# EasyEDA Pro project Display.eprj

# Board PCB1
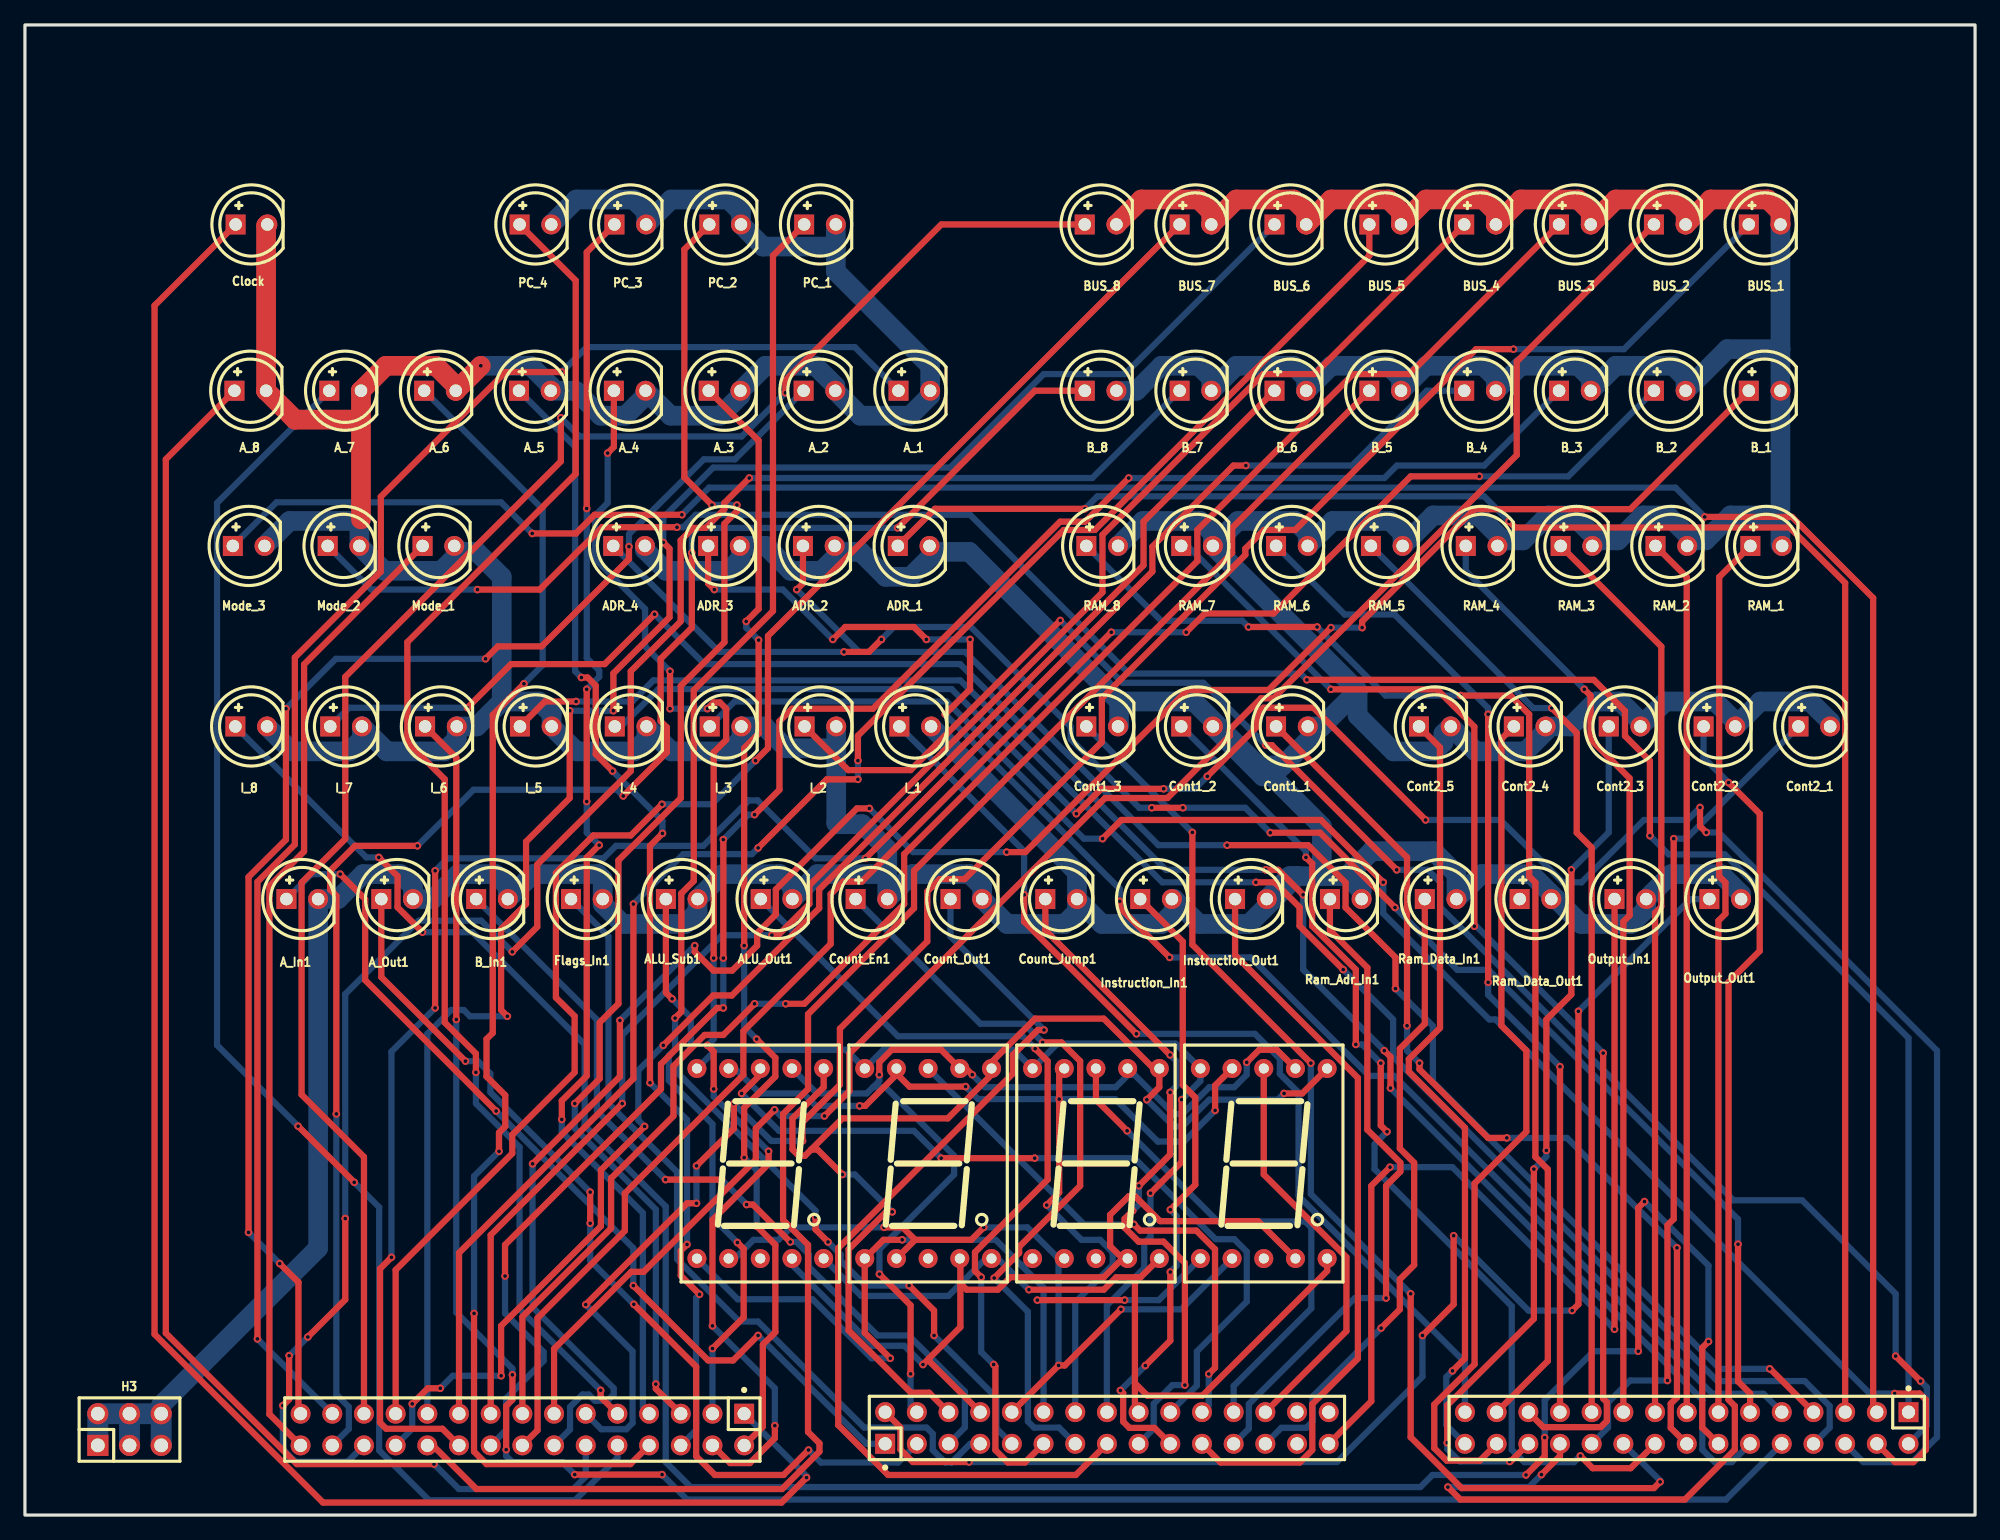
[diagram p0: board, top side]
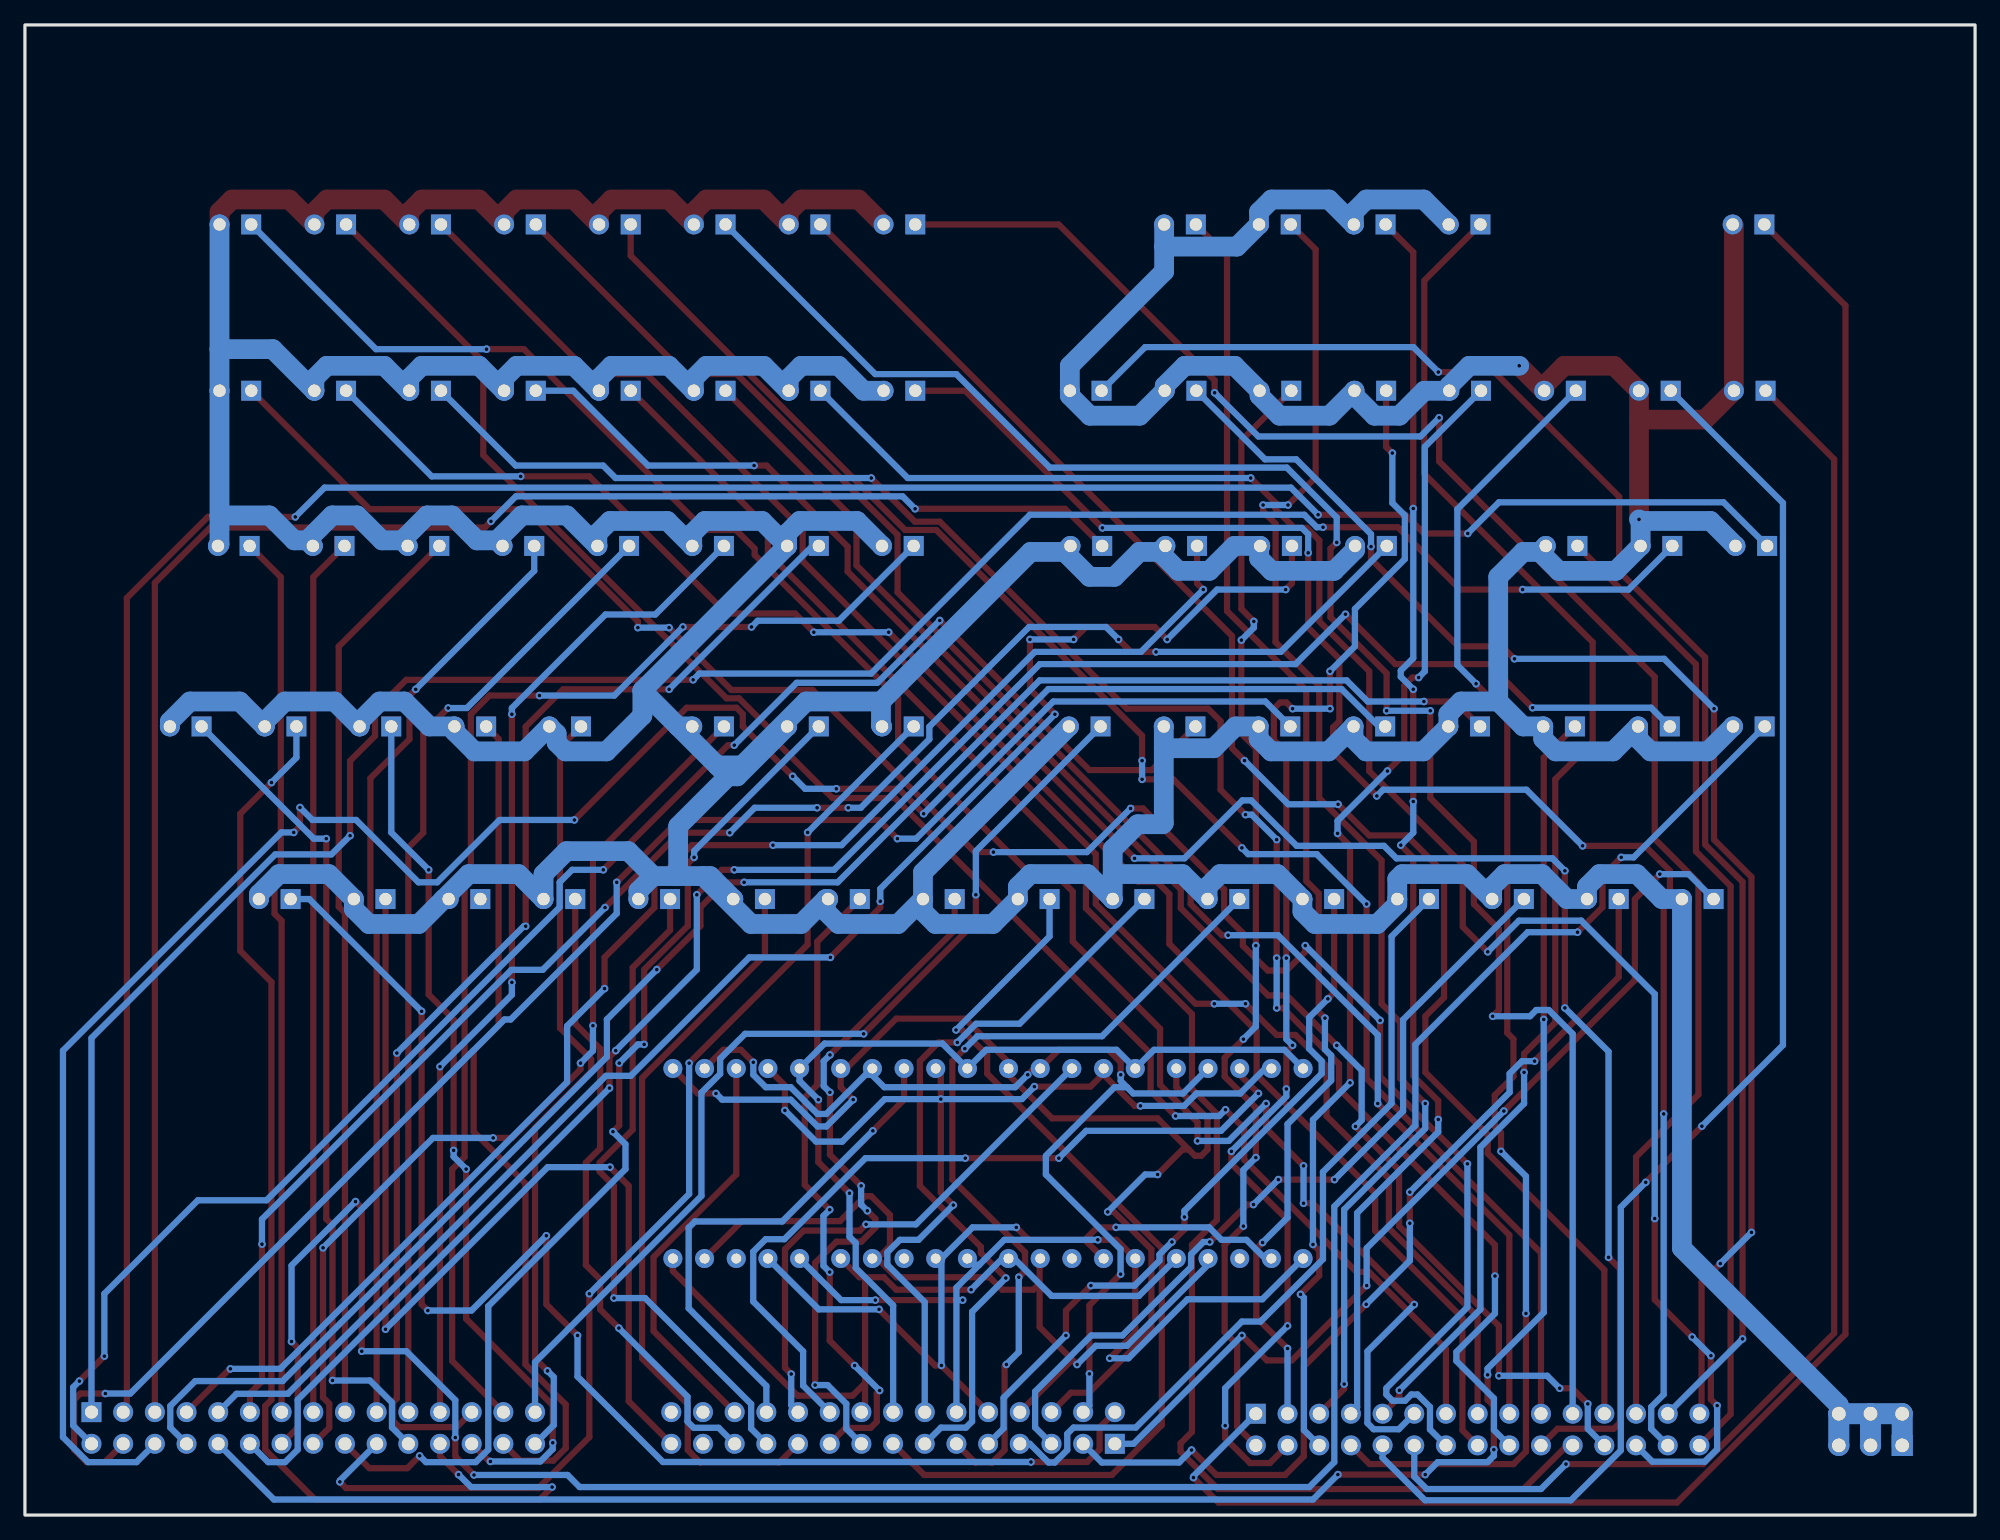
[diagram p1: board, bottom side, seen from below]

Outline 156.34 x 119.51 mm; copper layers: Top Layer, Bottom Layer. Coordinates in mm from the lower left corner of the outline.
Outline path: rectangle 0,119.51 156.34,0
Stack: Top Layer 0.035mm / Dielectric1 1.51mm FR4 er 4.5 / Bottom Layer 0.035mm

## Design rules (mm)
template: Custom Config
spacing copperThickness1oz (default): track to track 0.102, other pairs 0.152 to 0.3
spacing copperThickness2oz: track to track 0.203, other pairs 0.152 to 0.3
track width copperThickness1oz (default): min 0.127, default 0.5, max 2.54
track width copperThickness2oz: min 0.203, default 2, max 2.54
differential pair differentialPair (default): width min 0.127, default 0.254, max 2.54; gap min 0.152, default 0.152
via viaSize (default): diameter min 0.5, default 0.61, max 10; hole min 0.3, default 0.305, max 6.3
net GND uses copperThickness2oz

## Placement (name value [footprint] x y rotation side)
A_1  -  [LED-TH_BD5.8-P2.54-FD]  71.3 90.17 0 top
A_2  -  [LED-TH_BD5.8-P2.54-FD]  63.69 90.17 0 top
A_3  -  [LED-TH_BD5.8-P2.54-FD]  56.09 90.17 0 top
A_4  -  [LED-TH_BD5.8-P2.54-FD]  48.48 90.17 0 top
A_5  -  [LED-TH_BD5.8-P2.54-FD]  40.88 90.17 0 top
A_6  -  [LED-TH_BD5.8-P2.54-FD]  33.27 90.17 0 top
A_7  -  [LED-TH_BD5.8-P2.54-FD]  25.67 90.17 0 top
A_8  -  [LED-TH_BD5.8-P2.54-FD]  18.06 90.17 0 top
A_In1  -  [LED-TH_BD5.8-P2.54-FD]  22.23 49.4 0 top
A_Out1  -  [LED-TH_BD5.8-P2.54-FD]  29.84 49.4 0 top
ADR_1  -  [LED-TH_BD5.8-P2.54-FD]  71.25 77.72 0 top
ADR_2  -  [LED-TH_BD5.8-P2.54-FD]  63.64 77.72 0 top
ADR_3  -  [LED-TH_BD5.8-P2.54-FD]  56.04 77.72 0 top
ADR_4  -  [LED-TH_BD5.8-P2.54-FD]  48.43 77.72 0 top
ALU_Out1  -  [LED-TH_BD5.8-P2.54-FD]  60.26 49.4 0 top
ALU_Sub1  -  [LED-TH_BD5.8-P2.54-FD]  52.65 49.4 0 top
B_1  -  [LED-TH_BD5.8-P2.54-FD]  139.47 90.17 0 top
B_2  -  [LED-TH_BD5.8-P2.54-FD]  131.86 90.17 0 top
B_3  -  [LED-TH_BD5.8-P2.54-FD]  124.26 90.17 0 top
B_4  -  [LED-TH_BD5.8-P2.54-FD]  116.65 90.17 0 top
B_5  -  [LED-TH_BD5.8-P2.54-FD]  109.05 90.17 0 top
B_6  -  [LED-TH_BD5.8-P2.54-FD]  101.44 90.17 0 top
B_7  -  [LED-TH_BD5.8-P2.54-FD]  93.84 90.17 0 top
B_8  -  [LED-TH_BD5.8-P2.54-FD]  86.23 90.17 0 top
B_In1  -  [LED-TH_BD5.8-P2.54-FD]  37.44 49.4 0 top
BUS_1  -  [LED-TH_BD5.8-P2.54-FD]  139.47 103.51 0 top
BUS_2  -  [LED-TH_BD5.8-P2.54-FD]  131.86 103.51 0 top
BUS_3  -  [LED-TH_BD5.8-P2.54-FD]  124.26 103.51 0 top
BUS_4  -  [LED-TH_BD5.8-P2.54-FD]  116.65 103.51 0 top
BUS_5  -  [LED-TH_BD5.8-P2.54-FD]  109.05 103.51 0 top
BUS_6  -  [LED-TH_BD5.8-P2.54-FD]  101.44 103.51 0 top
BUS_7  -  [LED-TH_BD5.8-P2.54-FD]  93.84 103.51 0 top
BUS_8  -  [LED-TH_BD5.8-P2.54-FD]  86.23 103.51 0 top
Clock  -  [LED-TH_BD5.8-P2.54-FD]  18.16 103.51 0 top
Cont1_1  -  [LED-TH_BD5.8-P2.54-FD]  101.57 63.25 0 top
Cont1_2  -  [LED-TH_BD5.8-P2.54-FD]  93.97 63.25 0 top
Cont1_3  -  [LED-TH_BD5.8-P2.54-FD]  86.36 63.25 0 top
Cont2_1  -  [LED-TH_BD5.8-P2.54-FD]  143.45 63.25 0 top
Cont2_2  -  [LED-TH_BD5.8-P2.54-FD]  135.84 63.25 0 top
Cont2_3  -  [LED-TH_BD5.8-P2.54-FD]  128.24 63.25 0 top
Cont2_4  -  [LED-TH_BD5.8-P2.54-FD]  120.63 63.25 0 top
Cont2_5  -  [LED-TH_BD5.8-P2.54-FD]  113.03 63.25 0 top
Count_En1  -  [LED-TH_BD5.8-P2.54-FD]  67.86 49.4 0 top
Count_Jump1  -  [LED-TH_BD5.8-P2.54-FD]  83.07 49.4 0 top
Count_Out1  -  [LED-TH_BD5.8-P2.54-FD]  75.47 49.4 0 top
Flags_In1  -  [LED-TH_BD5.8-P2.54-FD]  45.05 49.4 0 top
H3  PZ254V-12-6P  [HDR-TH_6P-P2.54-V-M-R2-C3-S2.54]  8.38 6.86 0 top
I_1  -  [LED-TH_BD5.8-P2.54-FD]  71.37 63.25 0 top
I_2  -  [LED-TH_BD5.8-P2.54-FD]  63.77 63.25 0 top
I_3  -  [LED-TH_BD5.8-P2.54-FD]  56.16 63.25 0 top
I_4  -  [LED-TH_BD5.8-P2.54-FD]  48.56 63.25 0 top
I_5  -  [LED-TH_BD5.8-P2.54-FD]  40.95 63.25 0 top
I_6  -  [LED-TH_BD5.8-P2.54-FD]  33.35 63.25 0 top
I_7  -  [LED-TH_BD5.8-P2.54-FD]  25.74 63.25 0 top
I_8  -  [LED-TH_BD5.8-P2.54-FD]  18.14 63.25 0 top
Instruction_In1  -  [LED-TH_BD5.8-P2.54-FD]  90.68 49.4 0 top
Instruction_Out1  -  [LED-TH_BD5.8-P2.54-FD]  98.28 49.4 0 top
LED1  SM420561N  [LED-SEG-TH_10P-L12.7-W19.0-P2.54-S15.24-BL]  58.95 28.19 0 top
LED2  SM420561N  [LED-SEG-TH_10P-L12.7-W19.0-P2.54-S15.24-BL]  72.41 28.19 0 top
LED3  SM420561N  [LED-SEG-TH_10P-L12.7-W19.0-P2.54-S15.24-BL]  85.86 28.19 0 top
LED4  SM420561N  [LED-SEG-TH_10P-L12.7-W19.0-P2.54-S15.24-BL]  99.31 28.19 0 top
Mode_1  -  [LED-TH_BD5.8-P2.54-FD]  33.15 77.72 0 top
Mode_2  -  [LED-TH_BD5.8-P2.54-FD]  25.54 77.72 0 top
Mode_3  -  [LED-TH_BD5.8-P2.54-FD]  17.94 77.72 0 top
Output_In1  -  [LED-TH_BD5.8-P2.54-FD]  128.7 49.4 0 top
Output_Out1  -  [LED-TH_BD5.8-P2.54-FD]  136.31 49.4 0 top
PC_1  -  [LED-TH_BD5.8-P2.54-FD]  63.74 103.51 0 top
PC_2  -  [LED-TH_BD5.8-P2.54-FD]  56.13 103.51 0 top
PC_3  -  [LED-TH_BD5.8-P2.54-FD]  48.53 103.51 0 top
PC_4  -  [LED-TH_BD5.8-P2.54-FD]  40.92 103.51 0 top
RAM_1  -  [LED-TH_BD5.8-P2.54-FD]  139.6 77.72 0 top
RAM_2  -  [LED-TH_BD5.8-P2.54-FD]  131.99 77.72 0 top
RAM_3  -  [LED-TH_BD5.8-P2.54-FD]  124.39 77.72 0 top
RAM_4  -  [LED-TH_BD5.8-P2.54-FD]  116.78 77.72 0 top
RAM_5  -  [LED-TH_BD5.8-P2.54-FD]  109.18 77.72 0 top
RAM_6  -  [LED-TH_BD5.8-P2.54-FD]  101.57 77.72 0 top
RAM_7  -  [LED-TH_BD5.8-P2.54-FD]  93.97 77.72 0 top
RAM_8  -  [LED-TH_BD5.8-P2.54-FD]  86.36 77.72 0 top
Ram_Adr_In1  -  [LED-TH_BD5.8-P2.54-FD]  105.89 49.4 0 top
Ram_Data_In1  -  [LED-TH_BD5.8-P2.54-FD]  113.49 49.4 0 top
Ram_Data_Out1  -  [LED-TH_BD5.8-P2.54-FD]  121.1 49.4 0 top
U2  PZ254V-12-30P  [HDR-TH_30P-P2.54-V-M-R2-C15-S2.54-BL]  39.88 6.86 180 top
U3  PZ254V-12-30P  [HDR-TH_30P-P2.54-V-M-R2-C15-S2.54-BL]  133.22 6.99 180 top
U4  PZ254V-12-30P  [HDR-TH_30P-P2.54-V-M-R2-C15-S2.54-BL]  86.74 6.99 0 top

## Footprints (pads in the part's own frame, mm; a bottom-side part is the same pattern mirrored in y, then rotated)
HDR-TH_6P-P2.54-V-M-R2-C3-S2.54
  rect 1.7x1.7 hole 1.1: 1(-2.54,-1.27)
  round 1.7 hole 1.1: 2(-2.54,1.27) 3(0,-1.27) 4(0,1.27) 5(2.54,-1.27) 6(2.54,1.27)
HDR-TH_30P-P2.54-V-M-R2-C15-S2.54-BL
  rect 1.6x1.6 hole 1.05: 1(-17.78,-1.27)
  round 1.6 hole 1.05: 2(-17.78,1.27) 3(-15.24,-1.27) 4(-15.24,1.27) 5(-12.7,-1.27) 6(-12.7,1.27) 7(-10.16,-1.27) 8(-10.16,1.27) 9(-7.62,-1.27) 10(-7.62,1.27) 11(-5.08,-1.27) 12(-5.08,1.27) 13(-2.54,-1.27) 14(-2.54,1.27) 15(0,-1.27) 16(0,1.27) 17(2.54,-1.27) 18(2.54,1.27) 19(5.08,-1.27) 20(5.08,1.27) 21(7.62,-1.27) 22(7.62,1.27) 23(10.16,-1.27) 24(10.16,1.27) 25(12.7,-1.27) 26(12.7,1.27) 27(15.24,-1.27) 28(15.24,1.27) 29(17.78,-1.27) 30(17.78,1.27)
LED-SEG-TH_10P-L12.7-W19.0-P2.54-S15.24-BL
  round 1.524 hole 0.8: 1(-5.08,-7.62) 2(-2.54,-7.62) 3(0,-7.62) 4(2.54,-7.62) 5(5.08,-7.62) 6(5.08,7.62) 7(2.54,7.62) 8(0,7.62) 9(-2.54,7.62) 10(-5.08,7.62)
LED-TH_BD5.8-P2.54-FD
  rect 1.6x1.6 hole 1: 1(-1.27,0)
  round 1.6 hole 1: 2(1.27,0)

## Nets
GND: A_1.2 A_2.2 A_3.2 A_4.2 A_5.2 A_6.2 A_7.2 A_8.2 A_In1.2 A_Out1.2 ADR_1.2 ADR_2.2 ADR_3.2 ADR_4.2 ALU_Out1.2 ALU_Sub1.2 B_1.2 B_2.2 B_3.2 B_4.2 B_5.2 B_6.2 B_7.2 B_8.2 B_In1.2 BUS_1.2 BUS_2.2 BUS_3.2 BUS_4.2 BUS_5.2 BUS_6.2 BUS_7.2 BUS_8.2 Clock.2 Cont1_1.2 Cont1_2.2 Cont1_3.2 Cont2_1.2 Cont2_2.2 Cont2_3.2 Cont2_4.2 Cont2_5.2 Count_En1.2 Count_Jump1.2 Count_Out1.2 Flags_In1.2 H3.1 H3.2 H3.3 H3.4 H3.5 H3.6 I_1.2 I_2.2 I_3.2 I_4.2 I_5.2 I_6.2 I_7.2 I_8.2 Instruction_In1.2 Instruction_Out1.2 Mode_1.2 Mode_2.2 Mode_3.2 Output_In1.2 Output_Out1.2 PC_1.2 PC_2.2 PC_3.2 PC_4.2 RAM_1.2 RAM_2.2 RAM_3.2 RAM_4.2 RAM_5.2 RAM_6.2 RAM_7.2 RAM_8.2 Ram_Adr_In1.2 Ram_Data_In1.2 Ram_Data_Out1.2
A_1: A_1.1 U2.27
A_2: A_2.1 U2.29
A_3: A_3.1 U2.2
A_4: A_4.1 U2.4
A_5: A_5.1 U2.6
A_6: A_6.1 U2.8
A_7: A_7.1 U2.10
A_8: A_8.1 U2.12
A_IN: A_In1.1 U4.1
A_OUT: A_Out1.1 U4.3
ADR_1: ADR_1.1 U3.5
ADR_2: ADR_2.1 U3.7
ADR_3: ADR_3.1 U3.9
ADR_4: ADR_4.1 U3.11
ALU_OUT: ALU_Out1.1 U4.11
ALU_SUB: ALU_Sub1.1 U4.9
B_1: B_1.1 U2.14
B_2: B_2.1 U2.16
B_3: B_3.1 U2.18
B_4: B_4.1 U2.20
B_5: B_5.1 U2.22
B_6: B_6.1 U2.24
B_7: B_7.1 U2.26
B_8: B_8.1 U2.28
B_IN: B_In1.1 U4.5
BUS_1: BUS_1.1 U2.11
BUS_2: BUS_2.1 U2.13
BUS_3: BUS_3.1 U2.15
BUS_4: BUS_4.1 U2.17
BUS_5: BUS_5.1 U2.19
BUS_6: BUS_6.1 U2.21
BUS_7: BUS_7.1 U2.23
BUS_8: BUS_8.1 U2.25
CLOCK: Clock.1 U2.1
CONT1_1: Cont1_1.1 U3.16
CONT1_2: Cont1_2.1 U3.18
CONT1_3: Cont1_3.1 U3.20
CONT2_1: Cont2_1.1 U3.22
CONT2_2: Cont2_2.1 U3.24
CONT2_3: Cont2_3.1 U3.26
CONT2_4: Cont2_4.1 U3.28
CONT2_5: Cont2_5.1 U3.30
COUNT_EN: Count_En1.1 U4.13
COUNT_JUMP: Count_Jump1.1 U4.17
COUNT_OUT: Count_Out1.1 U4.15
DISP_A: LED1.7 LED2.7 LED3.7 LED4.7 U4.4
DISP_B: LED1.6 LED2.6 LED3.6 LED4.6 U4.6
DISP_C: LED1.4 LED2.4 LED3.4 LED4.4 U4.8
DISP_D: LED1.2 LED2.2 LED3.2 LED4.2 U4.10
DISP_DP: LED1.5 LED2.5 LED3.5 LED4.5 U4.18
DISP_E: LED1.1 LED2.1 LED3.1 LED4.1 U4.12
DISP_F: LED1.9 LED2.9 LED3.9 LED4.9 U4.14
DISP_G: LED1.10 LED2.10 LED3.10 LED4.10 U4.16
DISP_GND_1: LED1.8 U4.20
DISP_GND_2: LED2.8 U4.22
DISP_GND_3: LED3.8 U4.24
DISP_GND_4: LED4.8 U4.26
FLAGS_IN: Flags_In1.1 U4.7
HLT: Output_Out1.1 U4.2
I_1: I_1.1 U3.29
I_2: I_2.1 U3.2
I_3: I_3.1 U3.4
I_4: I_4.1 U3.6
I_5: I_5.1 U3.8
I_6: I_6.1 U3.10
I_7: I_7.1 U3.12
I_8: I_8.1 U3.14
INSTRUCTION_IN: Instruction_In1.1 U4.19
INSTRUCTION_OUT: Instruction_Out1.1 U4.21
MODE_1: Mode_1.1 U2.30
MODE_2: Mode_2.1 U3.1
MODE_3: Mode_3.1 U3.3
OUTPUT_IN: Output_In1.1 U4.29
PC_1: PC_1.1 U2.3
PC_2: PC_2.1 U2.5
PC_3: PC_3.1 U2.7
PC_4: PC_4.1 U2.9
RAM_1: RAM_1.1 U3.13
RAM_2: RAM_2.1 U3.15
RAM_3: RAM_3.1 U3.17
RAM_4: RAM_4.1 U3.19
RAM_5: RAM_5.1 U3.21
RAM_6: RAM_6.1 U3.23
RAM_7: RAM_7.1 U3.25
RAM_8: RAM_8.1 U3.27
RAM_ADR_IN: Ram_Adr_In1.1 U4.23
RAM_DATA_IN: Ram_Data_In1.1 U4.25
RAM_DATA_OUT: U4.27
$1N6232: Ram_Data_Out1.1

Pads without a net: LED1 3; LED2 3; LED3 3; LED4 3; U4 28 30

## Via types
v1: diameter 0.61, hole 0.305, Top Layer to Bottom Layer, 286 vias

## Routing (per net, layer and track width the routed paths; a pad name or vN(x,y) marks a point on that pad's centre or on a via; arc(x,y) is an arc through that point)
GND: length 863
  Top Layer w1.577: BUS_8.2 89.5,105.51 94.11,105.51 95.11,104.51 BUS_7.2 97.11,105.51 101.71,105.51 102.71,104.51 BUS_6.2 104.71,105.51 109.32,105.51 110.32,104.51 BUS_5.2 112.32,105.51 116.92,105.51 117.92,104.51 BUS_4.2 119.92,105.51 124.53,105.51 125.53,104.51 BUS_3.2 127.53,105.51 132.13,105.51 133.13,104.51 BUS_2.2 135.13,105.51 139.74,105.51 140.74,104.51 BUS_1.2 ; v1(36.54,92.17) A_6.2 34.54,90.57 32.94,92.17 28.94,92.17 A_7.2 26.94,87.85 ; 26.94,87.85 21.65,87.85 A_8.2 19.33,103.41 Clock.2 ; 26.94,87.85 v1(26.94,79.85)
  Bottom Layer w1.577: 57.39,77.72 59.39,77.72 61.39,75.72 63.87,75.72 65.39,77.25 ; 57.39,77.72 ADR_3.2 ; 57.39,77.72 57.39,76.72 56.39,75.72 51.39,75.72 49.7,77.41 ADR_4.2 ; 118.5,78.17 116.5,80.17 112.89,80.17 RAM_5.2 110.44,78.72 109.44,79.72 104.84,79.72 RAM_6.2 102.84,78.72 101.84,79.72 97.24,79.72 RAM_7.2 ; 118.5,78.17 120.1,78.17 122.1,80.17 124.1,80.17 126.1,78.17 ; 118.5,78.17 RAM_4.2 ; 103.97,63.25 100.84,60.12 ; 103.97,63.25 106.84,66.12 ; 103.97,63.25 Cont1_1.2 ; 100.84,60.12 98.84,60.12 93.71,65.25 87.71,65.25 ; 100.84,60.12 99.97,59.25 ; 105.97,51.25 107.97,53.25 112.92,53.25 114.76,51.4 Ram_Data_In1.2 116.76,51.4 120.76,51.4 122.76,49.4 ; 105.97,51.25 103.97,51.25 ; 105.97,51.25 107.16,50.06 Ram_Adr_In1.2 ; 140.74,93.51 B_1.2 140.74,80.17 ; 140.74,93.51 BUS_1.2 ; 140.74,93.51 136.47,93.51 B_2.2 133.13,91.17 132.13,92.17 127.53,92.17 B_3.2 125.53,91.17 124.53,92.17 119.92,92.17 B_4.2 117.92,91.17 116.92,92.17 112.32,92.17 B_5.2 110.32,91.17 109.32,92.17 104.71,92.17 B_6.2 102.71,91.17 101.71,92.17 97.11,92.17 B_7.2 95.11,91.17 94.11,92.17 91.11,92.17 89.11,90.17 B_8.2 ; 87.71,65.25 75.71,77.25 73,77.25 ; 87.71,65.25 87.71,63.33 Cont1_3.2 ; 126.1,78.17 127.71,78.17 129.71,80.17 131.71,80.17 133.71,78.17 ; 126.1,78.17 RAM_3.2 ; 65.39,77.25 ADR_2.2 ; 65.39,77.25 67,77.25 69,75.25 71,75.25 73,77.25 ; 122.76,49.4 124.76,47.4 128.76,47.4 129.97,48.61 Output_In1.2 131.97,51.4 135.97,51.4 137.58,49.8 Output_Out1.2 ; 122.76,49.4 Ram_Data_Out1.2 ; 69.13,51.4 Count_En1.2 71.13,51.4 75.74,51.4 76.74,50.4 Count_Out1.2 78.74,47.4 83.34,47.4 84.34,48.4 Count_Jump1.2 ; 69.13,51.4 63.53,51.4 ALU_Out1.2 61.53,50.4 60.53,51.4 55.92,51.4 ALU_Sub1.2 53.92,48.4 52.92,47.4 47.92,47.4 46.32,49.01 46.32,51.01 45.92,51.4 40.71,51.4 B_In1.2 38.71,50.4 37.71,51.4 34.71,51.4 32.71,49.4 A_Out1.2 31.11,50.4 30.11,51.4 27.11,51.4 25.11,49.4 A_In1.2 23.5,21.4 10.92,8.82 H3.6 ; 69.13,51.4 69.13,53.4 67.13,55.4 65.13,55.4 65.04,55.5 65.04,61.5 ; 38.22,65.25 36.22,63.25 I_6.2 34.62,62.25 33.62,61.25 29.01,61.25 I_7.2 27.01,62.25 26.01,61.25 21.41,61.25 I_8.2 ; 38.22,65.25 38.22,75.25 36.22,77.25 34.9,77.25 ; 38.22,65.25 41.22,65.25 42.22,64.25 I_5.2 44.22,61.25 48.83,61.25 49.83,62.25 I_4.2 51.83,61.25 56.43,61.25 57.43,62.25 I_3.2 59.29,63.25 61.04,61.5 65.04,61.5 ; 140.74,80.17 140.74,77.85 RAM_1.2 ; 140.74,80.17 136.74,80.17 134.74,78.17 133.71,78.17 ; 73,77.25 ADR_1.2 ; 133.71,78.17 RAM_2.2 ; 34.9,77.25 33.37,75.72 28.81,75.72 Mode_2.2 26.81,79.72 ; 34.9,77.25 Mode_1.2 ; 99.97,59.25 103.97,55.25 103.97,51.25 ; 99.97,59.25 99.24,59.25 Cont1_2.2 ; 106.84,66.12 106.84,64.12 109.71,61.25 113.01,61.25 113.71,61.95 113.71,62.66 Cont2_5.2 116.3,61.25 120.3,61.25 121.91,62.85 Cont2_4.2 123.91,63.25 125.91,65.25 127.91,65.25 129.51,63.64 Cont2_3.2 131.51,65.25 135.51,65.25 137.12,63.64 Cont2_2.2 139.12,65.25 143.12,65.25 144.72,63.64 Cont2_1.2 ; 106.84,66.12 RAM_7.2 ; PC_4.2 44.19,105.51 48.8,105.51 49.8,104.51 PC_3.2 51.8,105.51 56.4,105.51 57.4,104.51 57.4,103.51 59.18,101.73 65.01,101.73 ; Mode_3.2 21.21,79.72 26.81,79.72 ; 26.81,79.72 v1(26.94,79.85) ; RAM_8.2 89.63,79.72 94.24,79.72 95.24,78.72 RAM_7.2 ; 65.01,101.73 65.01,99.73 72.57,92.17 A_1.2 72.57,89.78 70.96,88.17 66.96,88.17 A_2.2 64.96,90.57 63.36,92.17 59.36,92.17 A_3.2 57.36,89.78 55.75,88.17 51.75,88.17 A_4.2 49.75,89.78 48.15,88.17 46.15,88.17 44.15,90.17 A_5.2 42.15,90.57 40.54,92.17 v1(36.54,92.17) ; 65.01,101.73 PC_1.2 ; 101.97,51.25 101.4,51.25 Instruction_Out1.2 ; 101.97,51.25 103.97,51.25 ; 101.97,51.25 98.12,47.4 94.12,47.4 92.12,49.4 ; 92.12,49.4 92.12,48.4 91.12,47.4 86.34,47.4 Count_Jump1.2 ; 92.12,49.4 Instruction_In1.2 ; 65.04,61.5 I_2.2 ; Count_Jump1.2 84.34,51.55 I_1.2
  Bottom Layer w1.675: H3.4 H3.6 H3.5 ; H3.4 H3.2 H3.1 ; H3.4 H3.3
A_1: length 128
  Top Layer w0.5: v1(18.64,14.13) 18.64,50.78 21.64,53.78 21.64,68.78 28.53,75.67 28.53,81.67 38.53,91.67 v1(43.03,91.67)
  Bottom Layer w0.5: v1(18.64,14.13) U2.27 ; v1(43.03,91.67) 45.03,93.67 66.53,93.67 A_1.1
A_2: length 112.7
  Top Layer w0.5: v1(17.92,22.67) 17.92,51.17 20.92,54.17 v1(20.92,64.67) ; v1(36.92,68.67) 37.92,69.67 41.42,69.67 48.42,76.67 v1(48.42,77.67) ; v1(20.42,20.17) 21.92,18.67 21.92,8.3 U2.29
  Bottom Layer w0.5: v1(36.92,68.67) 24.92,68.67 v1(20.92,64.67) ; v1(48.42,77.67) 48.42,78.67 54.42,84.67 56.92,84.67 A_2.1 ; v1(17.92,22.67) v1(20.42,20.17)
A_3: length 91.7
  Top Layer w0.5: v1(57.66,45.67) 57.66,61.51 58.82,62.67 v1(58.82,70.17) ; U2.2 59.16,7.09 59.16,13.67 60.16,14.67 60.16,21.67 v1(58.66,23.17) ; v1(57.82,71.67) 58.82,72.67 58.82,86.17 A_3.1 ; v1(57.66,28.67) 57.66,32.67 60.16,35.17 60.16,36.67 v1(58.66,38.17)
  Bottom Layer w0.5: v1(58.66,23.17) 58.66,27.67 v1(57.66,28.67) ; v1(57.66,45.67) 57.66,39.17 v1(58.66,38.17) ; v1(57.82,71.67) 57.82,71.17 v1(58.82,70.17)
A_4: length 105
  Top Layer w0.5: v1(54.71,37.67) 55.21,37.17 v1(55.21,34.17) ; v1(60.12,7.17) 60.12,6.17 58.12,4.17 56.54,4.17 55.12,5.59 ; v1(46.71,85.17) 47.21,85.67 A_4.1 ; v1(55.12,15.17) 55.12,23.67 59.62,28.17 v1(59.62,29.17) ; v1(54.71,64.67) 55.21,65.17 55.71,65.17 56.21,64.67 56.21,62.17 55.21,61.17 v1(55.21,44.67) ; v1(51.71,67.67) v1(51.71,64.67)
  Bottom Layer w0.5: v1(55.21,44.67) 55.21,38.17 v1(54.71,37.67) ; v1(55.12,15.17) 60.12,10.17 v1(60.12,7.17) ; v1(46.71,85.17) 46.71,81.17 45.71,80.17 45.71,76.67 49.71,72.67 49.71,69.67 v1(51.71,67.67) ; v1(51.71,64.67) v1(54.71,64.67) ; v1(59.62,29.17) 55.21,33.57 v1(55.21,34.17)
A_5: length 92.7
  Top Layer w0.5: v1(53.08,21.7) 52.58,21.2 52.58,19.2 v1(54.08,17.7) ; v1(47.11,59.67) 45.76,61.02 45.76,66.52 45.11,67.17 v1(44.61,67.17) ; v1(51.11,54.67) 50.11,53.67 v1(50.11,34.67)
  Bottom Layer w0.5: v1(50.11,34.67) 53.08,31.7 v1(53.08,21.7) ; v1(54.08,17.7) 53.8,17.43 53.8,6.81 U2.6 ; A_5.1 44.11,85.67 44.11,67.67 v1(44.61,67.17) ; v1(51.11,54.67) 51.11,55.67 v1(47.11,59.67)
A_6: length 107.6
  Top Layer w0.5: v1(36,16.17) 36,5.09 37,4.09 48.54,4.09 50.04,5.59 ; v1(40,66.67) 37.5,64.17 37.5,38.67 37,38.17 37,35.17 38.5,33.67 38.5,31.17 38,30.67 v1(38,29.17)
  Bottom Layer w0.5: v1(36,16.17) 36,27.17 v1(38,29.17) ; A_6.1 41.5,80.67 41.5,68.17 v1(40,66.67)
A_7: length 117.3
  Top Layer w0.5: v1(21.9,31.19) v1(26.4,26.69)
  Bottom Layer w0.5: v1(21.9,31.19) 15.4,37.69 15.4,81.17 A_7.1 ; v1(26.4,26.69) 28.4,24.69 28.4,5.19 32.4,1.19 44.1,1.19 47.5,4.59 U2.10
A_8: length 119.6
  Top Layer w0.5: v1(32.79,4.09) 21.79,4.09 11.29,14.59 11.29,84.67 A_8.1
  Bottom Layer w0.5: U2.12 44.96,3.09 43.96,2.09 34.79,2.09 v1(32.79,4.09)
A_IN: length 75
  Top Layer w0.5: v1(48.77,18.4) 54.77,12.4 56.77,12.4 v1(58.77,14.4) ; v1(25.27,51.4) 27.27,49.4 27.27,42.9 v1(37.77,32.4)
  Bottom Layer w0.5: v1(58.77,14.4) 67.46,5.72 U4.1 ; v1(37.77,32.4) 48.77,21.4 v1(48.77,18.4) ; A_In1.1 22.96,51.4 v1(25.27,51.4)
A_OUT: length 75.9
  Top Layer w0.5: A_Out1.1 28.57,43.15 v1(35.31,36.4) ; v1(48.81,16.9) 53.81,11.9 53.81,4.72 55.31,3.22 60.81,3.22 v1(62.81,5.22) ; v1(45.31,25.9) v1(45.31,23.4)
  Bottom Layer w0.5: v1(45.31,25.9) 37.31,33.9 37.31,35.4 36.31,36.4 v1(35.31,36.4) ; v1(48.81,16.9) 45.31,20.4 v1(45.31,23.4) ; v1(62.81,5.22) 63.81,4.22 70,4.22 U4.3
ADR_1: length 147
  Top Layer w0.5: v1(84.98,80.7) 72.95,80.7 ADR_1.1 ; U3.5 145.92,74.76 141.48,79.2 119.48,79.2 v1(118.98,79.7)
  Bottom Layer w0.5: v1(84.98,80.7) 85.98,81.7 116.98,81.7 v1(118.98,79.7)
ADR_2: length 117.8
  Top Layer w0.5: U3.7 139.91,11.72 v1(139.87,11.72) ; v1(61.87,74.22) 62.37,74.72 ADR_2.1 ; v1(96.37,53.72) 102.87,53.72 105.87,50.72 105.87,48.72 109.87,44.72 v1(109.87,42.22)
  Bottom Layer w0.5: v1(139.87,11.72) 135.87,11.72 112.87,34.72 112.87,39.22 v1(109.87,42.22) ; v1(61.87,74.22) 66.87,69.22 75.37,69.22 90.87,53.72 v1(96.37,53.72)
ADR_3: length 124.7
  Top Layer w0.5: v1(64.77,70.22) 65.77,71.22 71.27,71.22 v1(72.27,70.22) ; v1(91.77,44.72) 87.77,48.72 v1(87.77,49.22) ; v1(55.27,74.22) 54.77,74.72 ADR_3.1 ; v1(73.77,64.22) 75.77,66.22 v1(75.77,70.22)
  Bottom Layer w0.5: v1(91.77,44.72) 98.27,44.72 107.77,35.22 109.77,35.22 135.27,9.72 139.37,9.72 U3.9 ; v1(87.77,49.22) 87.77,50.22 v1(73.77,64.22) ; v1(64.77,70.22) 60.77,74.22 v1(55.27,74.22) ; v1(72.27,70.22) v1(75.77,70.22)
ADR_4: length 130.7
  Top Layer w0.5: v1(99.83,54.72) 103.83,54.72 v1(109.83,48.72) ; v1(137.33,21.72) 137.33,10.72 138.3,9.75 U3.11 ; v1(65.66,69.22) 67.66,69.22 v1(68.66,70.22) ; v1(90.33,56.72) v1(92.83,56.72)
  Bottom Layer w0.5: ADR_4.1 55.66,69.22 v1(65.66,69.22) ; v1(109.83,48.72) 114.83,43.72 117.33,43.72 137.33,23.72 v1(137.33,21.72) ; v1(92.83,56.72) 97.83,56.72 v1(99.83,54.72) ; v1(90.33,56.72) 89.33,56.72 83.83,62.22 83.83,63.22 75.83,71.22 69.66,71.22 v1(68.66,70.22)
ALU_OUT: length 67.6
  Top Layer w0.5: v1(77.66,12.08) 77.8,11.94 77.8,5.22 78.8,4.22 80.16,4.22 U4.11 ; v1(80.99,37.4) 81.99,36.4 81.99,26.9 76.16,21.08 76.16,19.58 v1(76.66,19.08)
  Bottom Layer w0.5: v1(80.99,37.4) 79.99,38.4 69.99,38.4 ALU_Out1.1 ; v1(76.66,19.08) 76.66,13.08 v1(77.66,12.08)
ALU_SUB: length 58.1
  Top Layer w0.5: v1(72.88,14.4) 72.88,16.4 v1(70.88,18.4) ; v1(64.38,21.9) 63.38,22.9 v1(63.38,23.9) ; v1(51.88,41.4) 51.38,41.9 ALU_Sub1.1
  Bottom Layer w0.5: U4.9 77.88,6.95 77.88,9.4 v1(72.88,14.4) ; v1(64.38,21.9) 65.38,20.9 65.38,20.4 67.38,18.4 v1(70.88,18.4) ; v1(51.88,41.4) 53.38,39.9 53.38,37.4 52.38,36.4 52.38,35.4 63.38,24.4 v1(63.38,23.9)
B_1: length 161.8
  Top Layer w0.5: v1(107.2,71.17) 107.2,71.67 116.2,80.67 128.7,80.67 B_1.1 ; v1(78.7,53.17) 80.2,53.17 93.2,66.17 99.7,66.17 v1(104.7,71.17) ; v1(40.7,28.17) 47.7,35.17 v1(47.7,39.67) ; v1(53.7,45.67) 53.7,45.17 55.2,43.67 56.7,43.67 58.7,45.67 58.7,46.67 60.2,48.17 60.2,50.17 66.7,56.67 v1(67.7,56.67)
  Bottom Layer w0.5: v1(107.2,71.17) v1(104.7,71.17) ; v1(67.7,56.67) 71.2,53.17 v1(78.7,53.17) ; v1(53.7,45.67) v1(47.7,39.67) ; v1(40.7,28.17) 40.7,16.67 47.2,10.17 47.2,9.67 46.7,9.17 45.7,9.17 45.2,9.67 44.7,9.67 43.7,8.67 43.7,6.87 U2.14
B_2: length 137.2
  Top Layer w0.5: v1(87.09,70.8) 67.09,50.8 65.59,50.8 64.59,49.8 64.59,45.8 57.59,38.8 57.59,35.3 48.09,25.8 48.09,22.8 41.09,15.8 41.09,6.8 U2.16 ; v1(116.59,83.3) 111.09,83.3 100.09,72.3 94.59,72.3 v1(93.09,70.8)
  Bottom Layer w0.5: v1(93.09,70.8) v1(87.09,70.8) ; v1(116.59,83.3) 123.73,83.3 B_2.1
B_3: length 144.3
  Top Layer w0.5: v1(88.49,83.17) 84.99,79.67 82.99,79.67 67.99,64.67 61.49,64.67 60.49,63.67 60.49,58.17 v1(58.49,56.17) ; v1(55.99,40.67) 55.49,40.67 50.99,36.17 50.99,34.17 38.49,21.67 v1(38.49,19.17) ; v1(55.99,54.17) v1(55.99,44.67)
  Bottom Layer w0.5: v1(38.49,19.17) 38.49,16.17 41.58,13.07 41.58,12.37 38.57,9.35 38.57,6.82 37.34,5.59 ; B_3.1 116.99,84.17 109.99,84.17 108.99,83.17 v1(88.49,83.17) ; v1(55.99,54.17) 57.99,56.17 v1(58.49,56.17) ; v1(55.99,44.67) v1(55.99,40.67)
B_4: length 156.6
  Top Layer w0.5: v1(97.88,84.17) 96.88,84.17 90.38,77.67 90.38,75.67 v1(67.38,52.67) ; U2.20 33.47,6.92 28.97,6.92 28.47,7.42 28.47,19.75 v1(29.38,20.67) ; v1(32.88,51.67) v1(32.88,40.67)
  Bottom Layer w0.5: v1(67.38,52.67) 63.38,52.67 58.74,57.32 58.03,57.32 54.38,53.67 47.38,53.67 46.38,52.67 33.88,52.67 v1(32.88,51.67) ; v1(97.88,84.17) 106.38,84.17 112.38,90.17 B_4.1 ; v1(29.38,20.67) 29.38,37.17 v1(32.88,40.67)
B_5: length 139.9
  Top Layer w0.5: B_5.1 96.78,79.17 96.78,77.17 71.28,51.67 71.28,48.67 62.78,40.17 62.78,34.17 60.78,32.17 60.78,23.67 62.78,21.67 62.78,6.67 63.7,5.75 63.7,5.09 60.7,2.09 36.2,2.09 32.7,5.59 32.26,5.59
B_6: length 117.9
  Top Layer w0.5: v1(31.05,8.92) 32.3,10.17 v1(33.3,10.17) ; B_6.1 89.67,79.67 89.67,76.17 63.67,50.17 63.67,48.67 56.67,41.67 55.17,41.67 v1(51.17,37.67) ; v1(38.17,11.17) 38.17,15.17 46.17,23.17 46.17,27.67 v1(49.67,31.17)
  Bottom Layer w0.5: U2.24 31.05,6.92 v1(31.05,8.92) ; v1(51.17,37.67) 49.17,35.67 49.17,31.67 v1(49.67,31.17) ; v1(33.3,10.17) 34.3,11.17 v1(38.17,11.17)
B_7: length 146.7
  Top Layer w0.5: v1(25.68,23.78) 25.68,17.28 v1(22.68,14.28) ; v1(21.18,12.78) 21.18,9.28 v1(20.68,8.78) ; v1(58.07,83.17) 56.07,81.17 56.07,80.67 54.57,79.17 53.57,79.17 52.57,78.17 52.57,71.67 48.57,67.67 48.57,59.67 41.07,52.17 41.07,47.17 v1(39.07,45.17)
  Bottom Layer w0.5: v1(25.68,23.78) 25.68,41.78 31.57,47.67 36.57,47.67 v1(39.07,45.17) ; v1(58.07,83.17) 85.57,83.17 B_7.1 ; U2.26 25.87,4.28 21.68,4.28 20.68,5.28 v1(20.68,8.78) ; v1(22.68,14.28) v1(21.18,12.78)
B_8: length 133.6
  Top Layer w0.5: B_8.1 80.96,90.17 v1(69.96,79.17) ; v1(24.96,32.17) 24.96,49.67 24.46,50.17 24.46,51.67 26.46,53.67 v1(31.46,53.67) ; v1(47.96,57.67) 51.46,61.17 51.46,63.17 50.96,63.67 50.96,68.67 53.46,71.17 v1(53.46,77.17)
  Bottom Layer w0.5: v1(31.46,53.67) 35.96,58.17 47.46,58.17 v1(47.96,57.67) ; v1(69.96,79.17) 53.96,79.17 53.46,78.67 v1(53.46,77.17) ; U2.28 25.96,6.91 25.96,8.67 24.96,9.67 v1(24.96,32.17)
B_IN: length 65.1
  Top Layer w0.5: v1(51.35,26.9) v1(55.85,26.9) ; v1(57.85,24.9) 58.35,24.9 v1(61.35,21.9)
  Bottom Layer w0.5: v1(55.85,26.9) v1(57.85,24.9) ; v1(61.35,21.9) 61.85,21.9 62.85,20.9 62.85,19.9 68.35,14.4 70.85,14.4 75.35,9.9 75.35,7.03 U4.5 ; v1(51.35,26.9) 45.85,32.4 45.85,39.72 B_In1.1
BUS_1: length 158.3
  Top Layer w0.5: v1(62.34,30) 62.34,31.5 65.34,34.5 65.34,39.01 72.34,46.01 72.34,50.01 73.34,51.01 75.34,51.01 86.34,62.01 86.34,65.51 97.84,77.01 97.84,77.51 99.34,79.01 101.84,79.01 116.34,93.51 v1(119.34,93.51) ; v1(56.84,33) 56.84,31 v1(53.84,28) ; v1(44.96,16.88) 53.08,25 v1(53.84,25)
  Bottom Layer w0.5: v1(53.84,28) v1(53.84,25) ; U2.11 46.2,6.88 48.21,6.88 48.71,7.38 48.71,13.13 v1(44.96,16.88) ; v1(119.34,93.51) 128.2,93.51 BUS_1.1 ; v1(62.34,30) 59.84,30 v1(56.84,33)
BUS_2: length 139.1
  Top Layer w0.5: BUS_2.1 119.59,92.51 119.59,85.01 100.09,65.51 99.09,65.51 96.59,63.01 96.59,62.51 91.59,57.51 86.59,57.51 66.09,37 66.09,34 v1(64.09,32) ; v1(60.09,32.5) 58.59,31 58.59,28.5 49.59,19.5 48.59,19.5 42.42,13.33 U2.13
  Bottom Layer w0.5: v1(60.09,32.5) 60.59,32 v1(64.09,32)
BUS_3: length 135.7
  Top Layer w0.5: U2.15 39.88,15.89 46.99,23 46.99,27 51.99,32 51.99,36 54.49,38.51 55.99,38.51 v1(58.49,41.01) ; BUS_3.1 110.99,91.51 106.49,91.51 93.99,79.01 93.99,76.51 70.49,53.01 70.49,49.01 62.49,41.01 v1(60.99,41.01)
  Bottom Layer w0.5: v1(60.99,41.01) v1(58.49,41.01)
BUS_4: length 132.7
  Top Layer w0.5: 37.34,8.13 37.34,22.46 v1(47.88,33) ; v1(59.88,46.51) 60.38,46.51 62.88,49.01 62.88,50.51 86.38,74.01 86.38,78.61 99.28,91.51 103.38,91.51 BUS_4.1
  Bottom Layer w0.5: v1(59.88,46.51) 55.88,46.51 47.88,38.51 v1(47.88,33)
BUS_5: length 131.8
  Top Layer w0.5: v1(58.78,53.51) 64.28,59.01 v1(66.78,59.01) ; BUS_5.1 107.78,101.01 85.78,79.01 83.28,79.01 66.78,62.51 v1(66.78,60.51) ; U2.19 34.8,21.03 48.78,35 v1(48.78,49.01)
  Bottom Layer w0.5: v1(58.78,53.51) 58.28,53.01 52.78,53.01 v1(48.78,49.01) ; v1(66.78,60.51) v1(66.78,59.01)
BUS_6: length 144.7
  Top Layer w0.5: v1(38.67,40.01) 38.17,40.51 38.17,47.01 40.17,49.01 40.17,54.01 43.67,57.51 v1(43.67,64.51) ; v1(47.17,64.51) 47.17,67.51 51.67,72.01 51.67,77.51 v1(51.17,78.01)
  Bottom Layer w0.5: v1(51.17,78.01) 51.17,80.01 55.17,84.01 74.17,84.01 81.67,91.51 88.17,91.51 BUS_6.1 ; v1(47.17,64.51) v1(43.67,64.51) ; v1(38.67,40.01) 35.67,40.01 35.17,40.51 34.17,40.51 32.26,38.59 32.26,8.13
BUS_7: length 126.8
  Top Layer w0.5: v1(51.07,57.01) 48.57,54.51 45.57,54.51 42.57,51.51 42.57,41.51 44.07,40.01 44.07,35.5 39.07,30.5 39.07,29 29.72,19.66 U2.23 ; BUS_7.1 59.57,70.51 59.57,61.51 v1(58.57,60.51)
  Bottom Layer w0.5: v1(58.57,60.51) 55.07,57.01 v1(51.07,57.01)
BUS_8: length 140.8
  Top Layer w0.5: v1(60.96,90.01) 60.96,91.01 73.46,103.51 BUS_8.1 ; v1(42.96,88.01) 42.96,84.51 25.68,67.22 25.68,54.22 22.18,50.72 22.18,33.72 27.18,28.72 U2.25
  Bottom Layer w0.5: v1(60.96,90.01) 57.46,86.51 44.46,86.51 v1(42.96,88.01)
CLOCK: length 157.6
  Top Layer w0.5: v1(62.66,3) 60.66,1 23.89,1 10.39,14.5 10.39,97.01 Clock.1
  Bottom Layer w0.5: v1(62.66,3) 62.66,3.13 U2.1
CONT1_1: length 75.3
  Top Layer w0.5: v1(111.8,36.25) 111.8,35.75 117.3,30.25 v1(118.8,30.25) ; v1(110.8,39.25) 110.8,52.75 Cont1_1.1 ; U3.16 131.94,7 131.94,8.93 132.44,9.43 v1(132.44,21.43)
  Bottom Layer w0.5: v1(118.8,30.25) 123.62,30.25 v1(132.44,21.43) ; v1(110.8,39.25) 110.8,37.25 v1(111.8,36.25)
CONT1_2: length 83.4
  Top Layer w0.5: v1(124.69,4.75) 125.68,3.76 128.73,3.76 U3.18 ; v1(108.69,36.25) 108.69,31.25 v1(109.19,30.75) ; v1(106.69,37.75) 106.69,43.75 103.19,47.25 103.19,52.25 v1(102.69,52.75)
  Bottom Layer w0.5: v1(124.69,4.75) 124.19,4.25 120.19,4.25 119.19,5.25 119.19,16.75 108.19,27.75 108.19,29.75 v1(109.19,30.75) ; v1(106.69,37.75) 107.19,37.75 v1(108.69,36.25) ; v1(102.69,52.75) 102.69,53.25 Cont1_2.1
CONT1_3: length 93.9
  Top Layer w0.5: v1(93.59,54.75) 93.59,45.75 v1(103.09,36.25) ; v1(131.09,2.66) 130.59,2.16 115.17,2.16 111.09,6.25 v1(111.09,17.75)
  Bottom Layer w0.5: Cont1_3.1 v1(93.59,54.75) ; v1(103.09,36.25) 103.09,25.75 v1(111.09,17.75) ; v1(131.09,2.66) 131.09,2.77 U3.20
CONT2_1: length 66.7
  Top Layer w0.5: v1(131.68,10.79) 131.68,23.25 132.18,23.75 v1(132.18,54.25)
  Bottom Layer w0.5: Cont2_1.1 133.18,54.25 v1(132.18,54.25) ; v1(131.68,10.79) 128.68,10.79 126.91,9.02 126.91,7.02 U3.22
CONT2_2: length 97.2
  Top Layer w0.5: v1(114.08,2.25) 115.08,1.25 133.08,1.25 137.08,5.25 137.08,8.75 136.58,9.25 136.58,42.75 139.08,45.25 139.08,56.25 v1(136.58,58.75) ; U3.24 123.06,4.73 v1(121.58,3.25)
  Bottom Layer w0.5: v1(121.58,3.25) 120.58,2.25 v1(114.08,2.25) ; v1(136.58,58.75) 134.58,60.75 Cont2_2.1
CONT2_3: length 70.8
  Top Layer w0.5: v1(121.97,29.25) 121.97,39.75 123.97,41.75 v1(123.97,51.75) ; v1(120.97,27.75) 120.97,15.75 114.02,8.8 v1(114.02,5.8) ; v1(119.02,4.3) 119.11,4.3 U3.26
  Bottom Layer w0.5: Cont2_3.1 126.97,54.75 v1(123.97,51.75) ; v1(114.02,5.8) 114.02,5.3 115.02,4.3 v1(119.02,4.3) ; v1(120.97,27.75) 121.97,28.75 v1(121.97,29.25)
CONT2_4: length 68.2
  Top Layer w0.5: U3.28 116.63,4.36 113.98,4.36 112.98,5.36 112.98,8.86 116.22,12.1 116.22,26.6 120.37,30.75 120.37,37.25 118.37,39.25 118.37,62.25 Cont2_4.1
CONT2_5: length 62.4
  Top Layer w0.5: Cont2_5.1 113.44,61.56 113.44,39.06 110.94,36.56 110.94,35.56 115.44,31.06 115.44,12.56 v1(114.44,11.56)
  Bottom Layer w0.5: v1(114.44,11.56) 113.94,11.06 113.94,7.22 U3.30
COUNT_EN: length 60.8
  Top Layer w0.5: v1(77.7,19.01) 79.7,21.01 79.7,21.51 84.59,26.4 84.59,36.4 83.09,37.9 v1(81.59,37.9)
  Bottom Layer w0.5: v1(81.59,37.9) 80.09,39.4 76.59,39.4 Count_En1.1 ; U4.13 82.9,7.01 80.9,7.01 80.4,7.51 80.4,16.31 v1(77.7,19.01)
COUNT_JUMP: length 55.1
  Top Layer w0.5: v1(91.8,36.9) 81.8,46.9 Count_Jump1.1 ; v1(91.8,33.9) 91.8,28.9 v1(89.3,26.4) ; v1(88.8,24.4) 88.16,23.76 88.16,23.05 89.28,21.93 91.28,21.93 92.99,20.22 v1(92.99,10.43)
  Bottom Layer w0.5: v1(92.99,10.43) 91.99,10.43 90.49,8.93 90.49,6.93 U4.17 ; v1(89.3,26.4) 89.3,24.9 v1(88.8,24.4) ; v1(91.8,36.9) 92.3,36.4 92.3,34.4 v1(91.8,33.9)
COUNT_OUT: length 76.7
  Top Layer w0.5: U4.15 84.24,3.22 69.2,3.22 65.2,7.22 65.2,21.4 79.2,35.4 79.2,36.9 81.2,38.9 v1(81.7,38.9)
  Bottom Layer w0.5: v1(81.7,38.9) 74.2,46.4 Count_Out1.1
DISP_A: length 83.4
  Top Layer w0.5: v1(71,11.32) 71,16.82 v1(68.5,19.32) ; v1(75.95,35.31) 75.45,35.81 LED2.7 73.45,37.31 69.49,37.31 68.49,36.31 v1(68.49,35.31) ; 101.85,35.81 100.35,37.31 98.95,37.31 v1(97.95,36.31)
  Bottom Layer w0.5: U4.4 71,8.75 v1(71,11.32) ; 88.45,35.31 87.45,34.31 76.95,34.31 v1(75.95,35.31) ; 88.45,35.31 LED3.7 ; 88.45,35.31 88.95,35.31 92.09,32.17 92.8,32.17 94.95,34.31 96.95,34.31 97.95,35.31 v1(97.95,36.31) ; LED1.7 63.49,33.81 67.49,33.81 67.99,34.31 ; v1(68.49,35.31) 68.49,34.81 67.99,34.31 ; 67.99,34.31 68.99,34.31 74.49,28.81 74.49,27.31 68.5,21.32 v1(68.5,19.32)
DISP_B: length 94.7
  Top Layer w0.5: v1(65.53,27.31) 63.53,29.31 63.03,29.31 ; 63.03,29.31 62.53,28.81 62.03,28.81 61.53,29.31 61.53,31.81 64.03,34.31 LED1.6 ; 63.03,29.31 65.53,31.81 73.99,31.81 77.49,35.31 LED2.6 77.49,36.31 80.99,39.81 86.49,39.81 90.49,35.81 90.94,35.81 90.94,34.31 v1(89.94,33.31) ; v1(69.53,24.31) 69.03,24.31 66.03,21.31 66.03,14.81 71.03,9.81 72.48,9.81 U4.6 ; LED4.6 102.39,33.81 v1(100.94,33.81)
  Bottom Layer w0.5: v1(69.53,24.31) 66.53,27.31 v1(65.53,27.31) ; v1(89.94,33.31) 92.09,31.17 92.79,31.17 94.94,33.31 100.44,33.31 v1(100.94,33.81)
DISP_C: length 66.2
  Top Layer w0.5: U4.8 72.49,12.34 72.49,12.57 ; v1(71.99,12.07) 72.49,12.57 ; 72.49,12.57 74.99,15.07 74.99,18.57 ; LED2.4 74.99,20.53 74.99,18.57 ; 74.99,18.57 75.49,18.07 77.99,18.07 78.99,19.07 86.49,19.07 87.99,20.57 ; 87.99,20.57 86.99,21.57 86.99,24.07 88.49,25.57 88.99,25.57 90.99,23.57 98.85,23.57 101.85,20.57 ; 87.99,20.57 LED3.4
  Bottom Layer w0.5: LED1.4 61.49,20.07 67.99,13.57 70.49,13.57 v1(71.99,12.07)
DISP_D: length 63.3
  Top Layer w0.5: v1(68.87,23.07) 70.37,23.07 71.37,22.07 ; 71.37,22.07 75.87,22.07 v1(76.87,23.07) ; 71.37,22.07 LED2.2 ; U4.10 v1(82.87,12) 83.37,12 v1(87.87,16.5)
  Bottom Layer w0.5: 82.87,20.57 83.32,20.57 ; 82.87,20.57 80.37,23.07 v1(76.87,23.07) ; 82.87,20.57 v1(82.87,12) ; v1(68.87,23.07) 61.41,23.07 60.41,22.07 58.41,22.07 56.91,20.57 LED1.2 ; v1(87.87,16.5) 92.7,16.5 LED4.2
DISP_DP: length 63.4
  Top Layer w0.5: 88.99,19.07 87.49,19.07 86.49,18.07 v1(80.49,18.07) ; 88.99,19.07 89.44,19.07 90.94,20.57 ; 88.99,19.07 88.99,10.57 ; 88.99,10.57 88.99,8.55 U4.18 ; 88.99,10.57 89.99,9.57 94.39,9.57 104.39,19.57 LED4.5
  Bottom Layer w0.5: v1(80.49,18.07) 77.99,20.57 LED2.5 77.03,20.57 74.03,17.57 67.03,17.57 LED1.5
DISP_E: length 70.3
  Top Layer w0.5: v1(69.37,12.57) 67.33,14.62 LED2.1 68.83,22.07 v1(70.33,22.07) ; v1(81.16,17.24) v1(88.16,17.24)
  Bottom Layer w0.5: v1(70.33,22.07) 77.83,22.07 79.83,20.07 ; 81.66,17.24 81.66,18.24 79.83,20.07 ; 81.66,17.24 v1(81.16,17.24) ; 81.66,17.24 U4.12 ; LED1.1 57.14,17.31 63.14,17.31 67.87,12.57 v1(69.37,12.57) ; v1(88.16,17.24) 90.9,17.24 94.23,20.57 ; 79.83,20.07 80.28,20.07 LED3.1
DISP_F: length 81.4
  Top Layer w0.5: 69.91,35.36 67.37,32.81 v1(66.91,32.81) ; 69.91,35.36 LED2.9 ; 69.91,35.36 70.91,34.36 v1(75.41,34.36) ; LED4.9 95.41,34.45 v1(95.41,32.45) ; 83.32,35.81 82.91,35.41 v1(82.91,33.36) 82.91,25.86 v1(81.91,24.86)
  Bottom Layer w0.5: v1(95.41,32.45) 92.91,29.95 90.82,29.95 87.41,33.36 v1(82.91,33.36) 76.41,33.36 v1(75.41,34.36) ; v1(66.91,32.81) 63.41,32.81 62.41,33.81 58.91,33.81 56.91,35.81 LED1.9 ; v1(81.91,24.86) 84.7,22.07 86.2,22.07 87.2,21.07 87.2,20.07 84.2,17.07 U4.14
DISP_G: length 75.2
  Top Layer w0.5: v1(92.73,33.31) 92.73,28.31 v1(90.23,25.81)
  Bottom Layer w0.5: LED1.10 55.37,37.31 65.83,37.31 LED2.10 68.83,37.31 79.28,37.31 LED3.10 82.78,37.81 92.23,37.81 94.23,35.81 94.23,34.81 v1(92.73,33.31) ; 86.73,8.26 86.73,16.81 89.73,19.81 89.73,21.81 90.23,22.31 v1(90.23,25.81)
DISP_GND_1: length 63.8
  Top Layer w0.5: v1(57.45,33.81) 58.95,35.31 LED1.8 ; v1(73.45,28.62) v1(80.95,28.62)
  Bottom Layer w0.5: v1(57.45,33.81) 60.45,30.81 71.26,30.81 v1(73.45,28.62) ; U4.20 93.95,10.39 93.95,13.12 97.95,17.12 97.95,21.12 96.95,22.12 95.45,22.12 88.95,28.62 v1(80.95,28.62)
DISP_GND_2: length 42.5
  Top Layer w0.5: v1(88.91,23.31) 89.41,22.81 93.91,22.81 95.41,21.31 95.41,11.81 v1(94.91,11.31)
  Bottom Layer w0.5: LED2.8 84.91,23.31 v1(88.91,23.31) ; v1(94.91,11.31) 94.91,8.8 U4.22
DISP_GND_3: length 41.4
  Top Layer w0.5: v1(88.36,30.81) 85.86,33.31 LED3.8
  Bottom Layer w0.5: v1(88.36,30.81) 95.63,23.55 102.63,23.55 103.13,23.05 103.13,16.58 96.9,10.36 U4.24
DISP_GND_4: length 33
  Top Layer w0.5: LED4.8 99.31,27.31 105.94,20.69 105.94,14.75 U4.26
FLAGS_IN: length 64.8
  Bottom Layer w0.5: Flags_In1.1 46.78,46.4 46.78,33.02 52.28,27.52 52.28,20.52 57.28,15.52 58.78,15.52 67.28,7.02 72.28,7.02 72.78,6.52 72.78,5.22 73.78,4.22 74.28,4.22 75.78,5.72 U4.7
HLT: length 111.4
  Top Layer w0.5: v1(114.54,22.4) 114.54,16.9 v1(112.04,14.4) ; v1(75.69,4.25) 71.19,4.25 70.19,5.25 70.19,7.03 U4.2 ; v1(124.54,40.4) 124.54,16.9 v1(124.04,16.4)
  Bottom Layer w0.5: Output_Out1.1 133.54,49.4 v1(124.54,40.4) ; v1(112.04,14.4) 112.04,11.11 105.19,4.25 v1(75.69,4.25) ; v1(114.54,22.4) 120.54,16.4 v1(124.04,16.4)
I_1: length 79.3
  Top Layer w0.5: v1(89.1,38.59) 80.1,47.59 v1(80.1,49.75)
  Bottom Layer w0.5: U3.29 115.44,12.25 102.1,25.59 102.1,33.88 100.6,35.38 100.6,36.59 98.6,38.59 v1(89.1,38.59) ; v1(80.1,49.75) 80.1,53.25 I_1.1
I_2: length 131.1
  Top Layer w0.5: v1(149.97,12.75) v1(151.97,10.75) ; v1(109.97,51.75) 99.97,61.75 v1(99.47,61.75) ; I_2.1 66,59.75 71,59.75 v1(83,71.75)
  Bottom Layer w0.5: U3.2 152.47,7.18 152.47,10.25 v1(151.97,10.75) ; v1(149.97,12.75) 149.97,17.75 142.47,25.25 136.97,25.25 113.47,48.75 113.47,50.75 112.47,51.75 v1(109.97,51.75) ; v1(99.47,61.75) 94.47,66.75 88,66.75 v1(83,71.75)
I_3: length 133.2
  Top Layer w0.5: v1(108.89,50.75) 103.89,55.75 87.89,55.75 v1(86.39,54.25) ; U3.4 149.93,4.25 151.39,4.25 152.39,5.25 152.39,9.25 151.89,9.75 v1(149.89,9.75)
  Bottom Layer w0.5: v1(86.39,54.25) 84.89,54.25 73.89,65.25 56.89,65.25 I_3.1 ; v1(108.89,50.75) 108.89,48.25 117.39,39.75 117.89,39.75 147.89,9.75 v1(149.89,9.75)
I_4: length 172.5
  Top Layer w0.5: v1(112.29,55.75) 103.29,64.75 99.29,64.75 98.79,64.25 98.79,63.25 v1(94.79,59.25) ; v1(91.29,58.25) 86.29,58.25 v1(84.29,56.25) ; v1(134.79,54.75) 134.29,55.25 v1(134.29,56.75)
  Bottom Layer w0.5: v1(84.29,56.25) 74.29,66.25 50.79,66.25 47.79,63.25 I_4.1 ; v1(112.29,55.75) 118.29,55.75 123.29,50.75 124.79,50.75 129.79,55.75 133.29,55.75 v1(134.29,56.75) ; v1(91.29,58.25) 93.79,58.25 v1(94.79,59.25) ; v1(134.79,54.75) 135.79,54.75 153.29,37.25 153.29,6.25 151.29,4.25 147.39,4.25 U3.6
I_5: length 136.8
  Top Layer w0.5: v1(105.68,43.75) 102.18,47.25 102.18,48.75 100.18,50.75 v1(98.68,50.75) ; v1(44.18,65.25) 41.68,65.25 I_5.1
  Bottom Layer w0.5: U3.8 144.68,7.02 144.68,8.75 142.68,10.75 135.68,10.75 109.68,36.75 109.68,39.75 v1(105.68,43.75) ; v1(44.18,65.25) 48.68,65.25 50.38,66.94 74.99,66.94 91.18,50.75 v1(98.68,50.75)
I_6: length 167.2
  Top Layer w0.5: v1(38.58,5.25) 38.58,8.75 39.08,9.25 v1(39.08,11.25) ; I_6.1 34.58,60.75 v1(34.58,39.75) ; v1(44.08,3.25) v1(51.08,3.25)
  Bottom Layer w0.5: v1(39.08,11.25) 39.08,11.75 34.58,16.25 v1(34.58,39.75) ; U3.10 136.37,1.25 53.08,1.25 v1(51.08,3.25) ; v1(44.08,3.25) 43.08,4.25 39.08,4.25 38.58,4.75 v1(38.58,5.25)
I_7: length 153.7
  Top Layer w0.5: v1(50.47,72.25) 46.47,68.25 38.97,68.25 v1(35.47,64.75) ; v1(99.47,51.75) 100.47,51.75 v1(102.47,49.75) ; v1(108.97,37.25) 109.47,36.75 v1(109.47,34.25)
  Bottom Layer w0.5: v1(108.97,37.25) 102.47,43.75 v1(102.47,49.75) ; v1(50.47,72.25) 54.47,68.25 74.97,68.25 91.47,51.75 v1(99.47,51.75) ; I_7.1 25.97,64.75 v1(35.47,64.75) ; v1(109.47,34.25) 134.47,9.25 134.47,5.25 135.47,4.25 136.83,4.25 U3.12
I_8: length 196.7
  Top Layer w0.5: v1(129.34,13.14) 129.34,24.64 v1(129.84,25.14) ; v1(31.87,46.75) 29.87,48.75 29.87,51.25 v1(28.37,52.75) ; v1(120.34,3.22) 121.84,4.72 v1(121.84,6.22) ; U3.14 134.47,7.01 134.47,13.42 v1(134.97,13.92)
  Bottom Layer w0.5: v1(129.34,13.14) 125.76,13.14 121.84,9.22 v1(121.84,6.22) ; v1(120.34,3.22) 112.84,3.22 111.87,2.25 53.37,2.25 51.37,4.25 51.37,24.75 44.87,31.25 44.87,37.75 35.87,46.75 v1(31.87,46.75) ; v1(129.84,25.14) 134.97,20.01 v1(134.97,13.92) ; v1(28.37,52.75) 27.37,52.75 I_8.1
INSTRUCTION_IN: length 51.2
  Top Layer w0.5: v1(91.82,19.49) 91.82,13.99 v1(89.82,11.99) ; v1(91.82,24.49) 93.82,26.49 93.82,33.49 92.82,34.49 92.82,45.99 Instruction_In1.1 ; U4.19 90.55,6.99 88.55,6.99 88.05,7.49 88.05,9.77 v1(87.82,9.99)
  Bottom Layer w0.5: v1(91.82,24.49) 92.32,23.99 92.32,19.99 v1(91.82,19.49) ; v1(89.82,11.99) v1(87.82,9.99)
INSTRUCTION_OUT: length 59.7
  Top Layer w0.5: U4.21 95.86,4.22 102.2,4.22 103.2,5.22 103.2,8.9 106.86,12.56 106.86,35.06 97.01,44.9 Instruction_Out1.1
MODE_1: length 78.3
  Top Layer w0.5: Mode_1.1 22.38,68.22 22.38,53.22 19.6,50.45 19.6,8.09 U2.30
MODE_2: length 182.7
  Top Layer w0.5: v1(36.27,74.22) 41.27,74.22 46.27,79.22 v1(52.27,79.22) ; v1(130.27,54.49) 130.27,60.49 128.27,62.49 128.27,64.49 125.77,66.99 v1(102.77,66.99)
  Bottom Layer w0.5: v1(52.27,79.22) 52.77,79.22 53.77,80.22 75.77,80.22 88.51,67.49 102.27,67.49 v1(102.77,66.99) ; v1(36.27,74.22) 27.77,74.22 Mode_2.1 ; U3.1 151,38.26 136.27,52.99 131.77,52.99 v1(130.27,54.49)
MODE_3: length 204.6
  Top Layer w0.5: v1(134.67,80.05) 141.67,80.05 148.17,73.55 148.17,8.55 U3.3 ; v1(40.67,78.72) 44.17,78.72 45.67,80.22 v1(52.67,80.22)
  Bottom Layer w0.5: v1(40.67,78.72) 38.17,81.22 20.17,81.22 Mode_3.1 ; v1(134.67,80.05) 132.32,82.4 54.84,82.4 v1(52.67,80.22)
OUTPUT_IN: length 82.1
  Top Layer w0.5: v1(109.43,27.9) 107.93,26.4 107.93,9.13 U4.29 ; Output_In1.1 v1(127.43,14.9)
  Bottom Layer w0.5: v1(109.43,27.9) 114.43,27.9 v1(127.43,14.9)
PC_1: length 103.4
  Top Layer w0.5: v1(52.12,39.86) 52.62,40.36 52.62,49.86 53.62,50.86 53.62,66.15 59.97,72.51 59.97,101.01 PC_1.1 ; v1(57.12,21.86) 57.62,21.36 57.62,15.86 v1(55.12,13.36)
  Bottom Layer w0.5: v1(57.12,21.86) 55.12,23.86 55.12,31.36 51.62,34.86 51.62,36.86 52.12,37.36 v1(52.12,39.86) ; v1(55.12,13.36) 55.12,8.13
PC_2: length 108
  Top Layer w0.5: v1(50.58,10.5) 50.58,10.13 U2.5 ; v1(55.08,81.01) 52.86,83.22 52.86,101.51 54.86,103.51 ; v1(44.08,33) 46.08,35 46.08,39.51 47.58,41.01 47.58,52.51 52.58,57.51 52.58,66.51 56.08,70.01 56.08,79.51 57.08,80.51 v1(57.08,81.01)
  Bottom Layer w0.5: v1(55.08,81.01) v1(57.08,81.01) ; v1(44.08,33) 44.08,31 50.58,24.5 v1(50.58,10.5)
PC_3: length 101.7
  Top Layer w0.5: PC_3.1 45.04,101.28 v1(45.04,80.73) ; v1(43.04,31.73) 43.04,33.23 45.04,35.23 45.04,52.73 v1(46.04,53.73) ; v1(45.04,66.23) v1(45.04,57.23)
  Bottom Layer w0.5: v1(45.04,80.73) 45.04,68.73 46.04,67.73 46.04,67.23 v1(45.04,66.23) ; v1(46.04,53.73) 45.04,54.73 v1(45.04,57.23) ; 50.04,8.13 49.54,8.63 49.54,24.23 43.04,30.73 v1(43.04,31.73)
PC_4: length 109.8
  Top Layer w0.5: PC_4.1 44.15,99.01 44.15,83.51 30.65,70.01 30.65,62.01 33.65,59.01 33.65,39.51 36.15,37 v1(36.15,35.5) ; U2.9 46.15,9.47 v1(46.15,10)
  Bottom Layer w0.5: v1(46.15,10) 39.65,16.5 39.65,29.5 36.15,33 v1(36.15,35.5)
RAM_1: length 70.9
  Top Layer w0.5: U3.13 135.76,47.66 136.33,48.22 136.33,50.72 135.83,51.22 135.83,75.22 RAM_1.1
RAM_2: length 70.5
  Top Layer w0.5: RAM_2.1 133.22,75.22 U3.15
RAM_3: length 73
  Top Layer w0.5: RAM_3.1 131.18,69.66 131.18,48.79 130.68,48.29 U3.17
RAM_4: length 75.1
  Top Layer w0.5: v1(125.01,66.22) 125.51,65.72 125.51,62.22 128.64,59.09 128.64,48.09 128.14,47.59 U3.19
  Bottom Layer w0.5: RAM_4.1 115.51,75.72 v1(125.01,66.22)
RAM_5: length 77.7
  Top Layer w0.5: U3.21 125.6,53.53 124.41,54.72 124.41,62.72 v1(122.41,64.72)
  Bottom Layer w0.5: RAM_5.1 120.91,64.72 v1(122.41,64.72)
RAM_6: length 81.2
  Top Layer w0.5: v1(117.3,64.22) v1(117.3,42.72) ; v1(123.06,35.96) U3.23
  Bottom Layer w0.5: RAM_6.1 105.8,72.22 109.8,72.22 117.3,64.72 v1(117.3,64.22) ; v1(123.06,35.96) 117.3,41.72 v1(117.3,42.72)
RAM_7: length 96.7
  Top Layer w0.5: v1(126.52,37.05) 126.52,9.35 126.82,9.05 126.82,7.55 126.32,7.05 121.73,7.05 U3.25 ; v1(104.69,66.22) 113.19,66.22 116.19,63.22 v1(116.19,47.22)
  Bottom Layer w0.5: RAM_7.1 93.19,77.72 v1(104.69,66.22) ; v1(126.52,37.05) 116.35,47.22 v1(116.19,47.22)
RAM_8: length 99.4
  Top Layer w0.5: v1(115.09,65.72) 119.09,65.72 120.59,64.22 120.59,51.22 121.09,50.72 121.09,28.72 122.09,27.72 122.09,12.36 U3.27 ; v1(98.09,71.22) v1(103.59,71.22)
  Bottom Layer w0.5: v1(98.09,71.22) 97.59,71.72 91.09,71.72 RAM_8.1 ; v1(103.59,71.22) 109.09,65.72 v1(115.09,65.72)
RAM_ADR_IN: length 53
  Top Layer w0.5: Ram_Adr_In1.1 104.62,46.9 107.62,43.9 107.62,30.9 110.26,28.26 110.26,27.55 109.12,26.4 v1(109.12,17.4)
  Bottom Layer w0.5: U4.23 98.12,6.93 98.12,8.9 106.62,17.4 v1(109.12,17.4)
RAM_DATA_IN: length 51.1
  Top Layer w0.5: v1(108.72,15) 110.22,16.5 110.22,18.9 111.37,20.05 111.37,28.26 110.22,29.4 110.22,37.4 112.22,39.4 Ram_Data_In1.1
  Bottom Layer w0.5: v1(108.72,15) 103.22,9.5 103.22,7.5 102.72,7 100.72,7 U4.25
